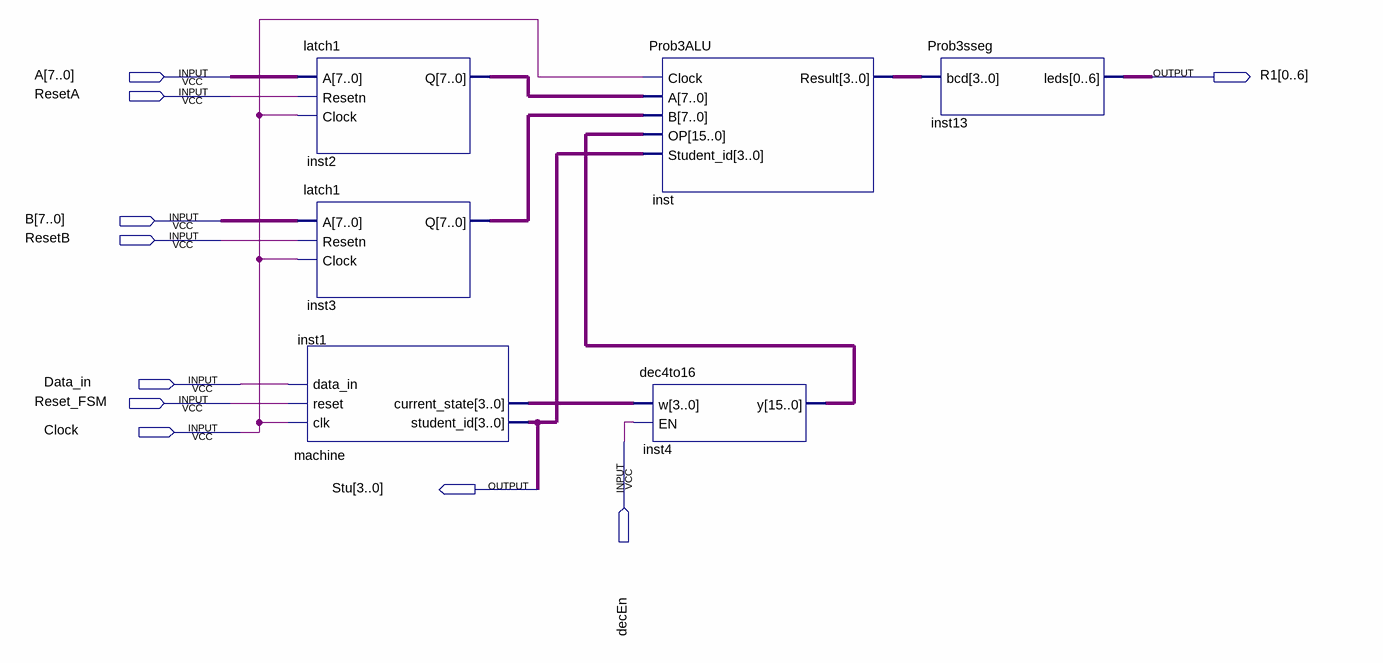
[diagram p0: schematic sheet]
// Quartus schematic Prob3Block.bdf as structural Verilog: 6 symbols, 10 pins
module Prob3Block (
  input  [7:0] A,
  input  ResetA,
  input  [7:0] B,
  input  ResetB,
  input  Data_in,
  input  Reset_FSM,
  input  Clock,
  input  decEn,
  output [0:6] R1,
  output [3:0] Stu
);

  wire [3:0] inst1_current_state, inst_result;
  wire [7:0] inst2_q, inst3_q;
  wire [15:0] inst4_y;

  machine inst1 (
    .clk(Clock), .reset(Reset_FSM), .data_in(Data_in), .student_id(Stu), .current_state(inst1_current_state));
  latch1 inst2 (.A(A), .Resetn(ResetA), .Clock(Clock), .Q(inst2_q));
  latch1 inst3 (.A(B), .Resetn(ResetB), .Clock(Clock), .Q(inst3_q));
  Prob3ALU inst (.Clock(Clock), .A(inst2_q), .B(inst3_q), .OP(inst4_y), .Student_id(Stu), .Result(inst_result));
  dec4to16 inst4 (.w(inst1_current_state), .EN(decEn), .y(inst4_y));
  Prob3sseg inst13 (.bcd(inst_result), .leds(R1));
endmodule
